# Altium schematic sheet Microcontroller Power.SchDoc: Microcontroller Power
size Letter; DrawnBy: Leonardo Marquez; Engineer: 4; Organization: Open Reflow Oven; Address1: leonardomarquez.com; Address2: github.com/marqueztronics; DocumentNumber: 001; Revision: A02; SheetNumber: 4; SheetTotal: 5
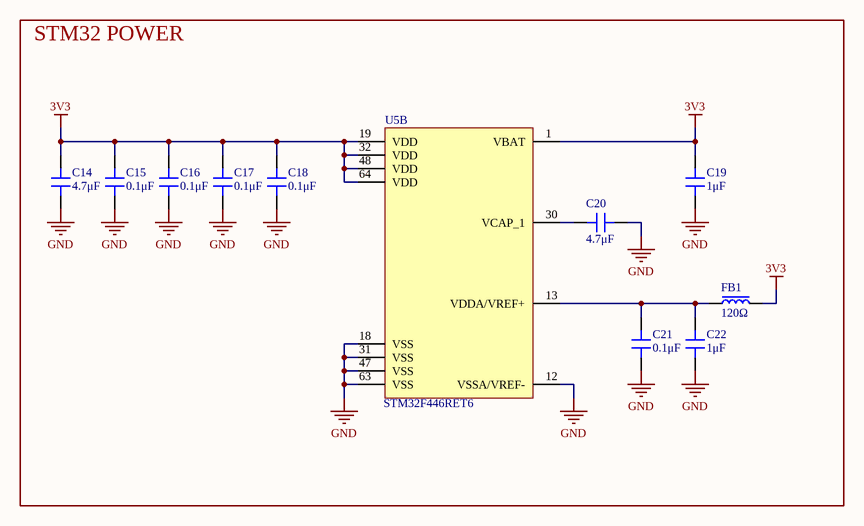
[diagram p0: Microcontroller Power.SchDoc]

## Parts
C14  4.7μF  [C0805]
C15  0.1μF  [C0603]
C16  0.1μF  [C0603]
C17  0.1μF  [C0603]
C18  0.1μF  [C0603]
C19  1μF  [C0603]
C20  4.7μF  [C0805]
C21  0.1μF  [C0603]
C22  1μF  [C0603]
FB1  120Ω  [FB0603]
U5  STM32F446RET6  [LQFP-64_10X10]  (part B of 2)

## Blocks framed on the sheet
STM32 POWER: C14-C22 FB1 U5

## Nets
3V3: C14.2 C15.2 C16.2 C17.2 C18.2 C19.2 FB1.2 U5.1(VBAT) U5.19(VDD) U5.32(VDD) U5.48(VDD) U5.64(VDD)
GND: C14.1 C15.1 C16.1 C17.1 C18.1 C19.1 C20.1 C21.1 C22.1 U5.12(VSSA/VREF-) U5.18(VSS) U5.31(VSS) U5.47(VSS) U5.63(VSS)
NetC20_2: C20.2 U5.30(VCAP_1)
NetC21_2: C21.2 C22.2 FB1.1 U5.13(VDDA/VREF+)

## Notes on the sheet
- Title
- Size:
- Date:
- Letter
- Number:
- Time:
- Revision:
- Sheet
- of
- File:

## Library data of the parts
C14 C20 = C-4.7UF-16V-X7R-C0805: 16V 4.7uF X7R ±10% 0805 Multilayer Ceramic Capacitors MLCC - SMD/SMT ROHS; Manufacturer: Taiyo Yuden; Manufacturer Part Number: EMK212B7475KG-T; Price Unit: 0.0182; Price 1K: 0.0145; Supplier 1: LCSC; Supplier Part Number 1: C92762
C15-C18 C21 = C-0.1UF-50V-X7R-C0603: 50V 100nF X7R ±10% 0603 Multilayer Ceramic Capacitors MLCC - SMD/SMT ROHS; Manufacturer: Samsung Electro-Mechanics; Manufacturer Part Number: CL10B104KB8NNNC; Price Unit: 0.0024; Price 1K: 0.0019; Supplier 1: LCSC; Supplier Part Number 1: C1591
C19 C22 = C-1UF-16V-X7R-C0603: 16V 1uF X7R ±10% 0603 Multilayer Ceramic Capacitors MLCC - SMD/SMT ROHS; Manufacturer: Samsung Electro-Mechanics; Manufacturer Part Number: CL10B105KO8NNNC; Price Unit: 0.0033; Price 1K: 0.0029; Supplier 1: LCSC; Supplier Part Number 1: C59782
FB1 = FB-120OHM-50MOHM-FB0603: 50mΩ ±25% 120Ω@100MHz 0603 Ferrite Beads ROHS; Manufacturer: Murata Electronics; Manufacturer Part Number: BLM18PG121SN1D; Price Unit: 0.0062; Price 1K: 0.0049; Supplier 1: LCSC; Supplier Part Number 1: C14709
U5 = U-STM32F446RET6-LQFP-64_10X10: 35A 1V@400mA 800mA 600V MBS Bridge Rectifiers ROHS; Manufacturer: STMicroelectronics; Manufacturer Part Number: STM32F446RET6; Price Unit: 3.3018; Price 1K: 2.3276; Supplier 1: LCSC; Supplier Part Number 1: C69336